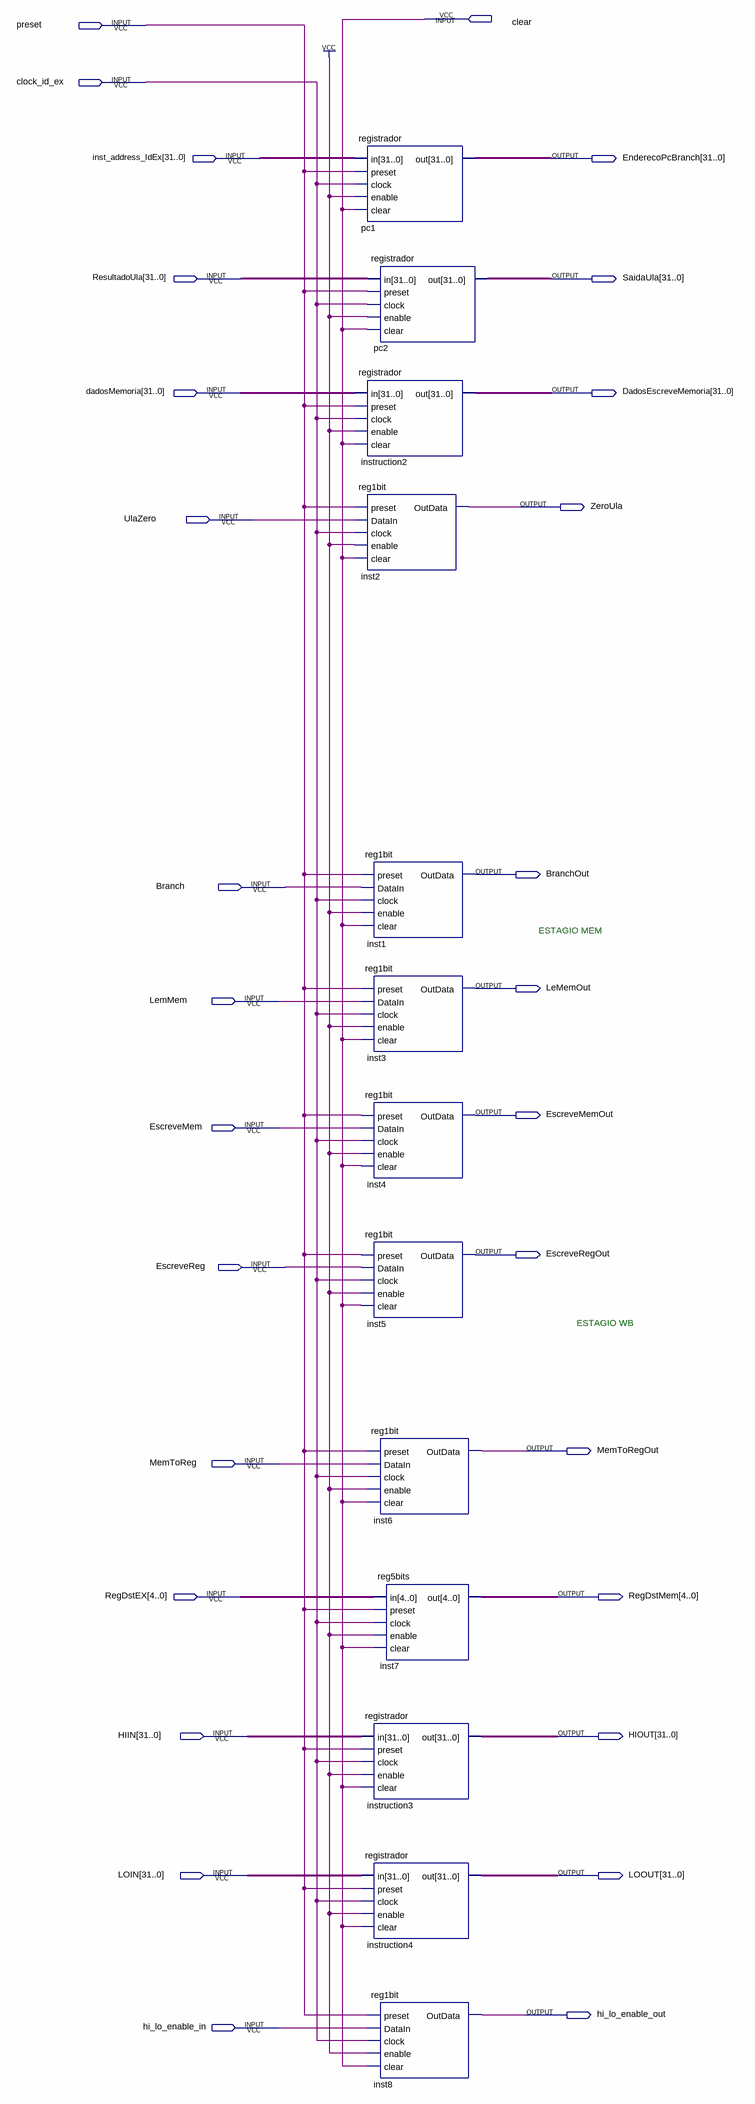
[diagram p0: schematic sheet]
// Quartus schematic EXMEM.bdf as structural Verilog: 13 symbols, 29 pins
module EXMEM (
  input  clear,
  input  preset,
  input  clock_id_ex,
  input  [31:0] inst_address_IdEx,
  input  [31:0] ResultadoUla,
  input  [31:0] dadosMemoria,
  input  UlaZero,
  input  Branch,
  input  LemMem,
  input  EscreveMem,
  input  EscreveReg,
  input  MemToReg,
  input  [4:0] RegDstEX,
  input  [31:0] HIIN,
  input  [31:0] LOIN,
  input  hi_lo_enable_in,
  output [31:0] EnderecoPcBranch,
  output [31:0] SaidaUla,
  output [31:0] DadosEscreveMemoria,
  output ZeroUla,
  output BranchOut,
  output LeMemOut,
  output EscreveMemOut,
  output EscreveRegOut,
  output MemToRegOut,
  output [4:0] RegDstMem,
  output [31:0] HIOUT,
  output [31:0] LOOUT,
  output hi_lo_enable_out
);

  registrador pc1 (
    .in(inst_address_IdEx), .preset(preset), .clock(clock_id_ex), .enable(1'b1), .clear(clear),
    .out(EnderecoPcBranch));
  registrador pc2 (
    .in(ResultadoUla), .preset(preset), .clock(clock_id_ex), .enable(1'b1), .clear(clear), .out(SaidaUla));
  registrador instruction2 (
    .in(dadosMemoria), .preset(preset), .clock(clock_id_ex), .enable(1'b1), .clear(clear),
    .out(DadosEscreveMemoria));
  reg1bit inst2 (
    .preset(preset), .DataIn(UlaZero), .clock(clock_id_ex), .enable(1'b1), .clear(clear), .OutData(ZeroUla));
  reg1bit inst1 (
    .preset(preset), .DataIn(Branch), .clock(clock_id_ex), .enable(1'b1), .clear(clear), .OutData(BranchOut));
  reg1bit inst3 (
    .preset(preset), .DataIn(LemMem), .clock(clock_id_ex), .enable(1'b1), .clear(clear), .OutData(LeMemOut));
  reg1bit inst4 (
    .preset(preset), .DataIn(EscreveMem), .clock(clock_id_ex), .enable(1'b1), .clear(clear),
    .OutData(EscreveMemOut));
  reg1bit inst5 (
    .preset(preset), .DataIn(EscreveReg), .clock(clock_id_ex), .enable(1'b1), .clear(clear),
    .OutData(EscreveRegOut));
  reg1bit inst6 (
    .preset(preset), .DataIn(MemToReg), .clock(clock_id_ex), .enable(1'b1), .clear(clear),
    .OutData(MemToRegOut));
  registrador instruction3 (.in(HIIN), .preset(preset), .clock(clock_id_ex), .enable(1'b1), .clear(clear), .out(HIOUT));
  registrador instruction4 (.in(LOIN), .preset(preset), .clock(clock_id_ex), .enable(1'b1), .clear(clear), .out(LOOUT));
  reg1bit inst8 (
    .preset(preset), .DataIn(hi_lo_enable_in), .clock(clock_id_ex), .enable(1'b1), .clear(clear),
    .OutData(hi_lo_enable_out));
  reg5bits inst7 (.in(RegDstEX), .preset(preset), .clock(clock_id_ex), .enable(1'b1), .clear(clear), .out(RegDstMem));

  // Notes on the sheet:
  //   ESTAGIO MEM
  //   ESTAGIO WB
endmodule
